# EAGLE design chgr (EAGLE 4.13)
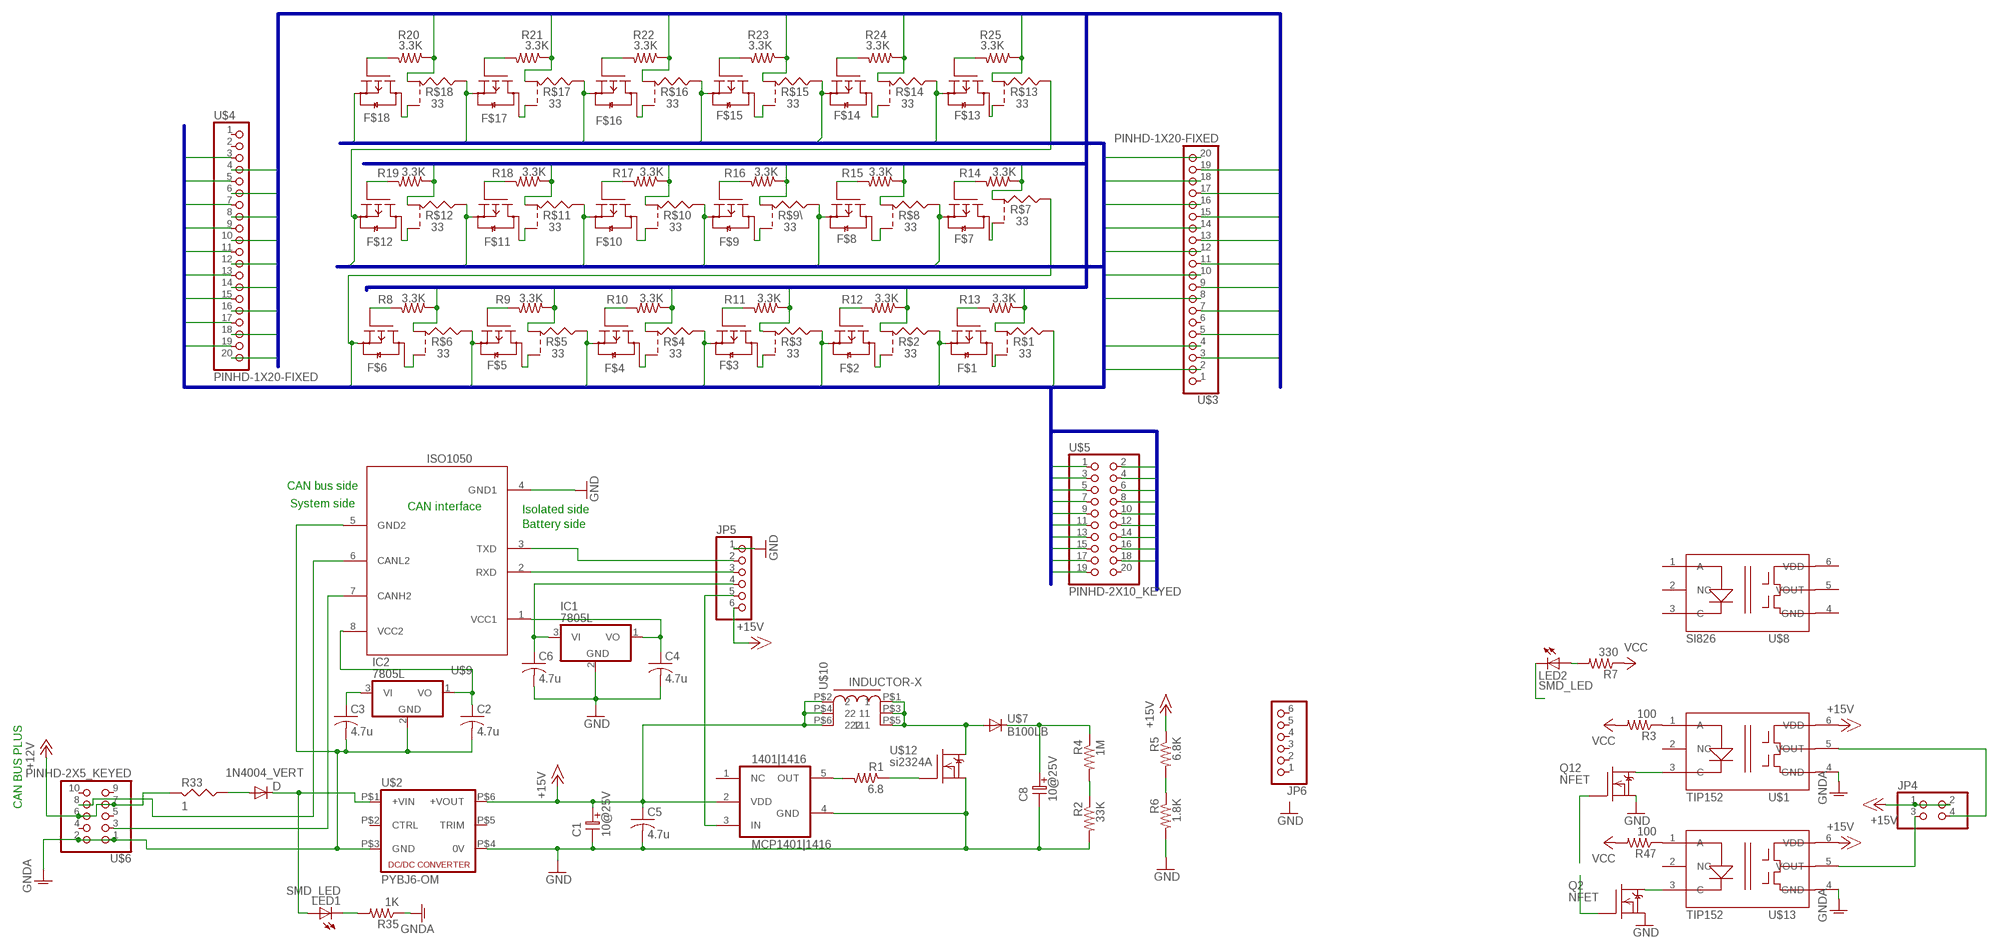
[diagram p0: schematic, sheet 1]

## Parts
1401|1416  MCP1401|1416  MCP1416  [SOT23-5]
C1  10@25V  ELC-2,5L  [ES-2,5L]
C2  4.7u  C-USC0603  [C0603]
C3  4.7u  C-USC0603  [C0603]
C4  4.7u  C-USC0603  [C0603]
C5  4.7u  C-USC0603  [C0603]
C6  4.7u  C-USC0603  [C0603]
C8  10@25V  ELC-2,5L  [ES-2,5L]
D  1N4004_VERT  [DO41-10_VERT]
F$1  FET-P-SOT23  [SOT-23]
F$2  FET-P-SOT23  [SOT-23]
F$3  FET-P-SOT23  [SOT-23]
F$4  FET-P-SOT23  [SOT-23]
F$5  FET-P-SOT23  [SOT-23]
F$6  FET-P-SOT23  [SOT-23]
F$7  FET-P-SOT23  [SOT-23]
F$8  FET-P-SOT23  [SOT-23]
F$9  FET-P-SOT23  [SOT-23]
F$10  FET-P-SOT23  [SOT-23]
F$11  FET-P-SOT23  [SOT-23]
F$12  FET-P-SOT23  [SOT-23]
F$13  FET-P-SOT23  [SOT-23]
F$14  FET-P-SOT23  [SOT-23]
F$15  FET-P-SOT23  [SOT-23]
F$16  FET-P-SOT23  [SOT-23]
F$17  FET-P-SOT23  [SOT-23]
F$18  FET-P-SOT23  [SOT-23]
IC1  7805L  [TO92]
IC2  7805L  [TO92]
JP4  PINHD-2X2  [2X02]
JP5  PINHD-1X6  [1X06]
JP6  PINHD-1X6  [1X06]
LED1  SMD_LED  [SMD_LED]
LED2  SMD_LED  [SMD_LED]
Q2  NFET  DMN3404L  [SOT-23]
Q12  NFET  DMN3404L  [SOT-23]
R1  6.8  R-US_R0603  [R0603]
R2  33K  R-US_R0603  [R0603]
R3  100  R-US_R0603  [R0603]
R4  1M  R-US_R0603  [R0603]
R5  6.8K  R-US_R0603  [R0603]
R6  1.8K  R-US_R0603  [R0603]
R7  330  R-US_R0603  [R0603]
R8  3.3K  R-US_R0603  [R0603]
R9  3.3K  R-US_R0603  [R0603]
R10  3.3K  R-US_R0603  [R0603]
R11  3.3K  R-US_R0603  [R0603]
R12  3.3K  R-US_R0603  [R0603]
R13  3.3K  R-US_R0603  [R0603]
R14  3.3K  R-US_R0603  [R0603]
R15  3.3K  R-US_R0603  [R0603]
R16  3.3K  R-US_R0603  [R0603]
R17  3.3K  R-US_R0603  [R0603]
R18  3.3K  R-US_R0603  [R0603]
R19  3.3K  R-US_R0603  [R0603]
R20  3.3K  R-US_R0603  [R0603]
R21  3.3K  R-US_R0603  [R0603]
R22  3.3K  R-US_R0603  [R0603]
R23  3.3K  R-US_R0603  [R0603]
R24  3.3K  R-US_R0603  [R0603]
R25  3.3K  R-US_R0603  [R0603]
R33  1  RESUS-S2,5  [RS-2,5]
R35  1K  R-US_R0603  [R0603]
R47  100  R-US_R0603  [R0603]
R$1  33  RESUS-S2,5-2  [RS-2,5-2]
R$2  33  RESUS-S2,5-2  [RS-2,5-2]
R$3  33  RESUS-S2,5-2  [RS-2,5-2]
R$4  33  RESUS-S2,5-2  [RS-2,5-2]
R$5  33  RESUS-S2,5-2  [RS-2,5-2]
R$6  33  RESUS-S2,5-2  [RS-2,5-2]
R$7  33  RESUS-S2,5-2  [RS-2,5-2]
R$8  33  RESUS-S2,5-2  [RS-2,5-2]
R$9\  33  RESUS-S2,5-2  [RS-2,5-2]
R$10  33  RESUS-S2,5-2  [RS-2,5-2]
R$11  33  RESUS-S2,5-2  [RS-2,5-2]
R$12  33  RESUS-S2,5-2  [RS-2,5-2]
R$13  33  RESUS-S2,5-2  [RS-2,5-2]
R$14  33  RESUS-S2,5-2  [RS-2,5-2]
R$15  33  RESUS-S2,5-2  [RS-2,5-2]
R$16  33  RESUS-S2,5-2  [RS-2,5-2]
R$17  33  RESUS-S2,5-2  [RS-2,5-2]
R$18  33  RESUS-S2,5-2  [RS-2,5-2]
U$1  TIP152  SI826  [SDIP6]
U$2  PYBJ6-OM  [PYBJ6-OM]
U$3  PINHD-1X20-FIXED  [1X20]
U$4  PINHD-1X20-FIXED  [1X20]
U$5  PINHD-2X10_KEYED  [2X10_KEYED]
U$6  PINHD-2X5_KEYED  [2X05_KEYED]
U$7  B100LB  [SMB_1]
U$8  SI826  [SDIP6]
U$9  ISO1050  [PDSO-G8]
U$10  INDUCTOR-X  [INDUCTOR]
U$12  si2324A  DMN3404L  [SOT-23]
U$13  TIP152  SI826  [SDIP6]

## Nets
+5VA: C2.1 IC2.1(VO) U$9.8(VCC2)
+5VB: C4.1 IC1.1(VO) U$9.1(VCC1)
+7V: C6.1 IC1.3(VI) JP5.4
+12V: R33.2 U$6.6 U$6.7
+12V_RESISTORED: D.A R33.1
+15V: 1401|1416.2(VDD) C1.1 C5.1 JP4.1 JP4.2 JP5.6 R5.1 U$1.6(VDD) U$2.P$6(+VOUT) U$10.P$2 U$10.P$4 U$10.P$6 U$13.6(VDD)
C0: R$1.1 U$3.2 U$5.1
C1: F$1.2(S) R$2.1 U$3.4 U$5.11
C2: F$2.2(S) R$3.1 U$5.2
C3: F$3.2(S) R$4.1 U$3.8 U$5.12
C4: F$4.2(S) R$5.1 U$3.10 U$5.3
C5: F$5.2(S) R$6.1 U$3.12 U$5.13
C6: F$6.2(S) R$7.1 U$3.14 U$5.4
C7: F$7.2(S) R$8.1 U$3.16 U$5.14
C8: F$8.2(S) R$9\.1 U$3.18 U$5.5
C9: F$9.2(S) R$10.1 U$3.20 U$5.15
C10: F$10.2(S) R$11.1 U$4.19 U$5.6
C11: F$11.2(S) R$12.1 U$4.17 U$5.16
C12: F$12.2(S) R$13.1 U$4.15 U$5.7
C13: F$13.2(S) R$14.1 U$4.13 U$5.17
C14: F$14.2(S) R$15.1 U$4.11 U$5.8
C15: F$15.2(S) R$16.1 U$4.9 U$5.18
C16: F$16.2(S) R$17.1 U$4.7 U$5.9
C17: F$17.2(S) R$18.1 U$4.5 U$5.19
C18: F$18.2(S) U$4.3 U$5.10
CAN+12PROTECT: D.C LED1.A U$2.P$1(+VIN)
CAN-RX: JP5.3 U$9.2(RXD)
CAN-TX: JP5.2 U$9.3(TXD)
CANH2: U$6.3 U$9.7(CANH2)
CANL2: U$6.8 U$9.6(CANL2)
CHG-PWM: 1401|1416.3(IN) JP5.5
CHG_FETDRV: 1401|1416.5(OUT) R1.2
GHR_FET_GATE: R1.1 U$12.1(G)
GND: 1401|1416.4(GND) C1.2 C4.2 C5.2 C6.2 C8.2 IC1.2(GND) JP5.1 Q2.2(S) Q12.2(S) R2.2 R6.2 U$2.P$4(0V) U$9.4(GND1) U$12.2(S)
GNDA: C2.2 C3.2 IC2.2(GND) R35.1 U$1.4(GND) U$2.P$3(GND) U$6.1 U$6.2 U$9.5(GND2) U$13.4(GND)
LED_BUS_PWR: LED1.C R35.2
LED|R: LED2.A R7.2
N$1: F$18.1(G) R20.2
N$2: C3.1 IC2.3(VI)
N$3: JP4.3 U$13.5(VOUT)
N$4: C8.1 R4.1 U$7.C
N$5: R2.1 R4.2
N$6: U$7.A U$10.P$1 U$10.P$3 U$10.P$5 U$12.3(D)
N$7: R5.2 R6.1
N$8: JP4.4 U$1.5(VOUT)
N$9: F$17.1(G) R21.2
N$10: R3.1 U$1.1(A)
N$11: R47.1 U$13.1(A)
N$12: Q12.3(D) U$1.3(C)
N$13: Q2.3(D) U$13.3(C)
N$14: Q2.1(G)
N$15: Q12.1(G)
N$16: F$16.1(G) R22.2
N$17: F$15.1(G) R23.2
N$18: F$14.1(G) R24.2
N$19: F$13.1(G) R25.2
N$20: F$7.1(G) R14.2
N$21: F$8.1(G) R15.2
N$22: F$9.1(G) R16.2
N$23: F$10.1(G) R17.2
N$24: F$11.1(G) R18.2
N$25: F$12.1(G) R19.2
N$26: F$6.1(G) R8.2
N$27: F$5.1(G) R9.2
N$28: F$4.1(G) R10.2
N$29: F$3.1(G) R11.2
N$30: F$2.1(G) R12.2
N$31: F$18.3(D) R$18.3
N$32: F$17.3(D) R$17.3
N$33: F$16.3(D) R$16.3
N$34: F$15.3(D) R$15.3
N$35: F$14.3(D) R$14.3
N$36: F$13.3(D) R$13.3
N$37: F$7.3(D) R$7.3
N$38: F$8.3(D) R$8.3
N$39: F$9.3(D) R$9\.3
N$40: F$10.3(D) R$10.3
N$41: F$11.3(D) R$11.3
N$42: F$12.3(D) R$12.3
N$43: F$6.3(D) R$6.3
N$44: F$5.3(D) R$5.3
N$45: F$4.3(D) R$4.3
N$46: F$3.3(D) R$3.3
N$47: F$2.3(D) R$2.3
N$48: F$1.3(D) R$1.3
N$49: F$1.1(G) R13.2
PB8|LED: LED2.C
S1: R13.1 R$1.2 U$3.3
S2: R12.1 R$2.2 U$3.5
S3: R11.1 R$3.2 U$3.7
S4: R10.1 R$4.2 U$3.9
S5: R9.1 R$5.2 U$3.11
S6: R8.1 R$6.2 U$3.13
S7: R14.1 R$7.2 U$3.15
S8: R15.1 R$8.2 U$3.17
S9: R16.1 R$9\.2 U$3.19
S10: R17.1 R$10.2 U$4.20
S11: R18.1 R$11.2 U$4.18
S12: R19.1 R$12.2 U$4.16
S13: R25.1 R$13.2 U$4.14
S14: R24.1 R$14.2 U$4.12
S15: R23.1 R$15.2 U$4.10
S16: R22.1 R$16.2 U$4.8
S17: R21.1 R$17.2 U$4.6
S18: R20.1 R$18.2 U$4.4
VCC: R3.2 R7.1 R47.2
Unconnected: 1401|1416.1(NC) JP6.1 JP6.2 JP6.3 JP6.4 JP6.5 JP6.6 U$1.2(NC) U$2.P$2(CTRL) U$2.P$5(TRIM) U$3.1 U$3.6 U$4.1 U$4.2 U$5.20 U$6.4 U$6.5 U$6.9 U$6.10 U$8.1(A) U$8.2(NC) U$8.3(C) U$8.5(VOUT) U$13.2(NC)

## Buses
C$1:C[0..18]
S$!:S[0..18]

## Notes on the sheet
- CAN bus side
- System side | CAN interface
- Isolated side
- Battery side
- CAN BUS PLUS

## Power pins joined to a net without a drawn wire
GND: U$8.4(GND)
VDD: U$8.6(VDD)

## Library data of the parts
1401|1416 = DEH:MCP1416
C1 C8 = DEH:ELC-2,5L
C2-C6 = rcl:C-US: CAPACITOR, American symbol
D = diode:1N4004_VERT
F$1-F$18 = transistor-fet:FET-P-SOT23
IC1 IC2 = linear:78*: Positive VOLTAGE REGULATOR
JP4 = pinhead:PINHD-2X2: PIN HEADER
JP5 JP6 = pinhead:PINHD-1X6: PIN HEADER
LED1 LED2 = led:SMD_LED
Q2 Q12 U$12 = transistor-fet:DMN3404L
R1-R25 R35 R47 = rcl:R-US_: RESISTOR, American symbol
R33 = DEH:RESUS-S2,5
R$1-R$8 R$9\ R$10-R$18 = DEH:RESUS-S2,5-2
U$1 U$8 U$13 = DEH:SI826
U$2 = dc-dc-converter:PYBJ6-OM
U$3 U$4 = pinhead:PINHD-1X20-FIXED
U$5 = pinhead:PINHD-2X10_KEYED
U$6 = pinhead:PINHD-2X5_KEYED
U$7 = diode-1:B100LB
U$9 = texas:ISO1050
U$10 = DEH:INDUCTOR-X

## Board
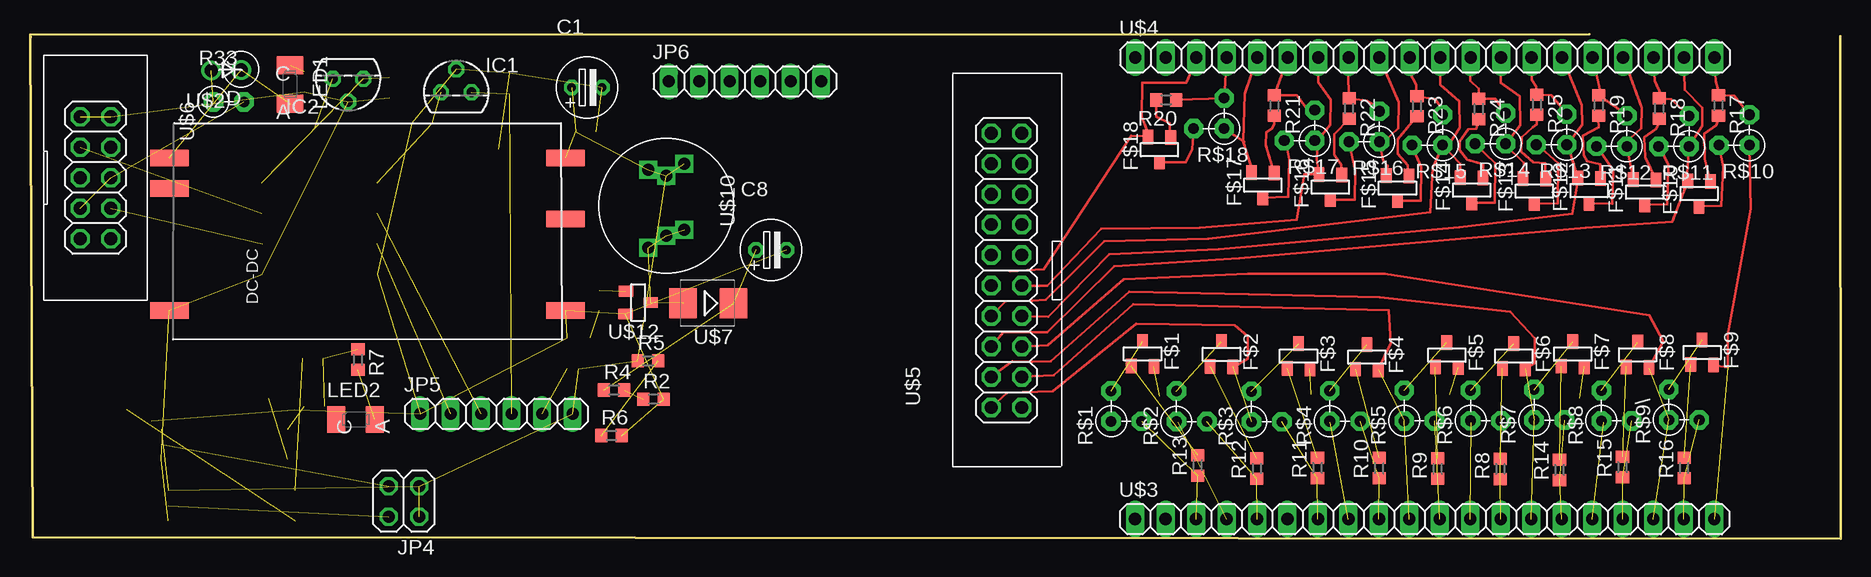
[diagram p1: board, top side]
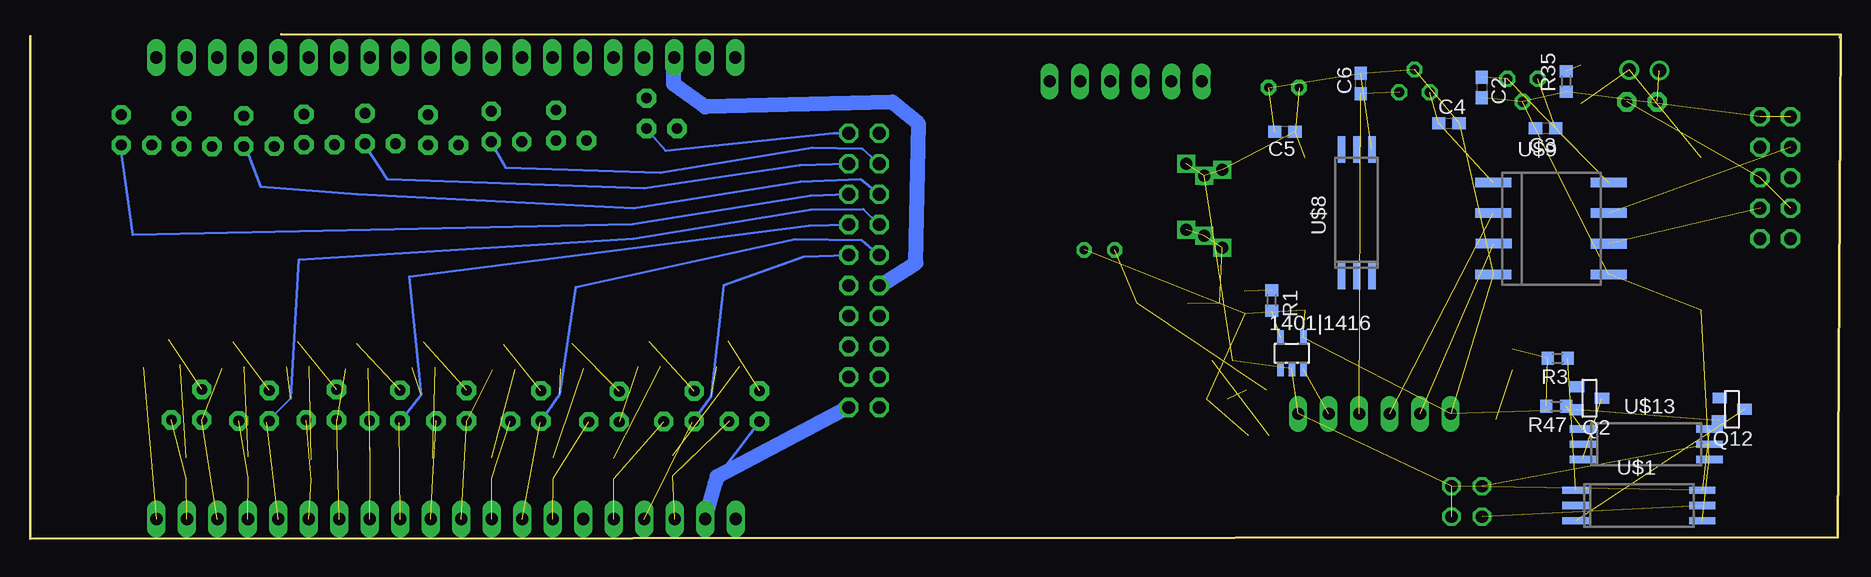
[diagram p2: board, bottom side, seen from below]

Size 150.89 x 42.04 mm. Coordinates in mm from the lower left corner, seen from the top.
Outline: 0,41.96 0.23,0.09 150.89,0 150.86,41.84
Outline: 0,41.96 0.07,41.79
Outline: 0,41.96 129.94,42.04
Copper layers (1*16): Top 0.035mm / dielectric 1.5mm / Bottom 0.035mm
Design rules "default": minimum track width 8mil, minimum drill 0.6mm, track to track 0.2083mm, track to pad 8mil, pad to pad 8mil, via to via 8mil, smd to smd 0mil, copper to edge 8mil, drill to drill 8mil, minimum pad ring 10mil, minimum via ring 8mil, stop-mask expansion 4mil, vias tented up to drill 0mil, thermal gap 10mil

### Footprints (pad centres in the part's own frame; a part is rotated, then mirrored left to right if it is on the bottom)
SOT23-5 = smd 0.55 x 1.2: 1 -0.95,-1.3; 2 0,-1.3; 3 0.95,-1.3; 4 0.95,1.3; 5 -0.95,1.3
ES-2,5L = drill 0.711 pad 1.27 octagon: 1 0,0; 2 2.54,0
C0603 = smd 1.1 x 1: 1 -0.85,0; 2 0.85,0
DO41-10_VERT = drill 1.1 round: A 2.58,0.05; C 0.07,0
SOT-23 = smd 0.9 x 1.2: 1 -1,-1.006; 2 0.9,-1.056; 3 -0.05,1.056
TO92 = drill 0.813 octagon: 1 -1.27,0; 2 0,1.905; 3 1.27,0
2X02 = drill 1.016 octagon: 1 -1.27,-1.27; 2 -1.27,1.27; 3 1.27,-1.27; 4 1.27,1.27
1X06 = drill 1 long: 1 -6.35,0; 2 -3.81,0; 3 -1.27,0; 4 1.27,0; 5 3.81,0; 6 6.35,0
SMD_LED = smd 2.2 x 1.5: A 0,1.6; C 0,-1.6
R0603 = smd 1 x 1.1: 1 -0.85,0; 2 0.85,0
RS-2,5 = drill 0.889 pad 1.6 octagon: 1 0,0; 2 2.54,0
RS-2,5-2 = drill 0.889 pad 1.6 octagon: 1 0,0; 2 2.54,0; 3 0,2.54
SDIP6 = smd 0.6 x 2.2: 1 -1.895,-5.33; 2 -0.625,-5.33; 3 0.645,-5.33; 4 0.645,5.22; 5 -0.625,5.22; 6 -1.895,5.22
PYBJ6-OM = smd 3.2 x 1.397: P$1 -16.51,6.35; P$2 -16.51,3.81; P$3 -16.51,-6.35; P$4 16.51,-6.35; P$5 16.51,1.27; P$6 16.51,6.35
1X20 = drill 1.016 long: 1 -24.13,0; 2 -21.59,0; 3 -19.05,0; 4 -16.51,0; 5 -13.97,0; 6 -11.43,0; 7 -8.89,0; 8 -6.35,0; 9 -3.81,0; 10 -1.27,0; 11 1.27,0; 12 3.81,0; 13 6.35,0; 14 8.89,0; 15 11.43,0; 16 13.97,0; 17 16.51,0; 18 19.05,0; 19 21.59,0; 20 24.13,0
2X10_KEYED = drill 1.067 octagon: 1 -11.46,-1.27; 2 -11.46,1.27; 3 -8.92,-1.27; 4 -8.92,1.27; 5 -6.38,-1.27; 6 -6.38,1.27; 7 -3.84,-1.27; 8 -3.84,1.27; 9 -1.3,-1.27; 10 -1.3,1.27; 11 1.24,-1.27; 12 1.24,1.27; 13 3.78,-1.27; 14 3.78,1.27; 15 6.32,-1.27; 16 6.32,1.27; 17 8.86,-1.27; 18 8.86,1.27; 19 11.4,-1.27; 20 11.4,1.27
2X05_KEYED = drill 1.067 octagon: 1 -5.08,-1.27; 2 -5.08,1.27; 3 -2.54,-1.27; 4 -2.54,1.27; 5 0,-1.27; 6 0,1.27; 7 2.54,-1.27; 8 2.54,1.27; 9 5.08,-1.27; 10 5.08,1.27
SMB_1 = smd 2.3 x 2.5: A 1.9,0; C -2.3,0
PDSO-G8 = smd 0.8 x 3: 1 -3.825,-4.8; 2 -1.275,-4.8; 3 1.265,-4.78; 4 3.825,-4.8; 5 3.825,4.8; 6 1.275,4.8; 7 -1.275,4.81; 8 -3.825,4.81
INDUCTOR = drill 1 pad 1.27 octagon: 1 -2.47,0 | drill 1 square: P$1 2.5,0; P$2 -2.5,0; P$3 2,1.5; P$4 -3,-1.5; P$5 3.5,-1.5; P$6 -3.5,1.5

### Placement (x,y rotation side)
1401|1416  45.73,15.44 0 bottom
C1  45.14,37.58 0 top
C2  29.92,37.58 270 bottom
C3  24.59,34.18 180 bottom
C4  32.65,34.6 0 bottom
C5  46.32,33.89 180 bottom
C6  39.98,37.92 90 bottom
C8  60.5,24.05 0 top
D  17.68,39.05 180 top
F$1  92.76,15.38 0 top
F$2  99.34,15.35 0 top
F$3  105.76,15.19 0 top
F$4  111.46,15.11 0 top
F$5  118.12,15.29 0 top
F$6  123.7,15.19 0 top
F$7  128.61,15.36 0 top
F$8  134.02,15.31 0 top
F$9  139.39,15.5 0 top
F$10  139.04,28.73 180 top
F$11  134.5,28.86 180 top
F$12  129.87,28.99 180 top
F$13  125.31,28.95 180 top
F$14  120.09,29.03 180 top
F$15  113.91,29.2 180 top
F$16  108.31,29.29 180 top
F$17  102.69,29.44 180 top
F$18  94.07,32.41 180 top
IC1  35.52,37.18 0 top
IC2  26.51,38.3 180 top
JP4  31.16,3.09 180 top
JP5  38.86,10.38 0 top
JP6  59.58,38.1 0 top
LED1  21.68,37.82 180 top
LED2  27.12,9.92 270 top
Q2  20.95,11.64 270 bottom
Q12  9.07,10.71 270 bottom
R1  47.42,19.84 270 bottom
R2  51.96,11.61 0 top
R3  23.58,15.02 180 bottom
R4  48.68,12.37 0 top
R5  51.51,14.81 0 top
R6  48.46,8.58 0 top
R7  27.33,14.91 270 top
R8  122.53,5.8 90 top
R9  117.31,5.82 90 top
R10  112.43,5.86 90 top
R11  107.29,5.89 90 top
R12  102.24,5.83 90 top
R13  97.31,6.09 90 top
R14  127.46,5.72 90 top
R15  132.71,5.95 90 top
R16  137.85,5.88 90 top
R17  140.71,36.08 270 top
R18  135.77,35.83 270 top
R19  130.73,36.09 270 top
R20  94.69,36.55 180 top
R21  103.69,36.07 270 top
R22  109.93,35.83 270 top
R23  115.58,36.02 270 top
R24  120.73,35.8 270 top
R25  125.57,36.15 270 top
R33  15.29,36.38 0 top
R35  22.87,38.09 90 bottom
R47  23.7,11.02 180 bottom
R$1  90.09,9.76 0 top
R$2  95.54,9.75 0 top
R$3  101.79,9.72 0 top
R$4  108.31,9.77 0 top
R$5  114.51,9.8 0 top
R$6  120.05,9.81 0 top
R$7  125.34,9.87 0 top
R$8  130.95,9.8 0 top
R$9\  136.57,9.88 0 top
R$10  143.29,32.78 90 top
R$11  138.26,32.67 90 top
R$12  133.08,32.68 90 top
R$13  128.06,32.82 90 top
R$14  122.97,32.9 90 top
R$15  117.72,32.78 90 top
R$16  112.45,33.06 90 top
R$17  107.06,33.16 90 top
R$18  99.51,34.16 90 top
U$1  16.76,2.12 270 bottom
U$2  28.12,25.36 0 top
U$3  116.22,1.62 0 top
U$4  116.24,40.09 0 top
U$5  81.38,22.38 90 top
U$6  5.45,30.07 270 top
U$7  56.33,19.61 180 top
U$8  39.71,27.21 0 bottom
U$9  24.14,25.84 270 bottom
U$10  53.03,27.74 270 top
U$12  50.67,19.61 270 top
U$13  16.16,7.23 270 bottom

### Tracks (layer width: path | path; a pad name or v marks a point on that pad's centre or on a via)
+5VA  (2 unrouted)
+5VB  (2 unrouted)
+7V  (2 unrouted)
+12V  (2 unrouted)
+12V_RESISTORED  (1 unrouted)
+15V  (12 unrouted)
C0
  Bottom 0.202: 93.81,4.57 93.98,4.62 R$1.1
  Bottom 1.27: U$5.1 93.64,5.16 93.81,4.57 94.71,1.5 U$3.2
C1  (2 unrouted)
  Bottom 0.202: U$5.11 86.43,23.49 93.06,21.1 94.13,11.84 95.69,9.69 R$2.1
C2  (1 unrouted)
  Top 0.202: U$5.2 81.45,12.15 85.21,12.28 92.19,17.88 100.4,17.79 101.47,16.86 101.47,14.97 100.26,14.29 F$2.2
C3  (2 unrouted)
  Bottom 0.202: U$5.12 81.56,24.85 87.11,24.95 105.43,20.95 106.75,12.03 108.36,9.69 R$4.1
C4  (2 unrouted)
  Top 0.202: U$5.3 85.3,13.59 91.95,19.51 113.24,19.04 113.4,16.28 112.3,14.03 F$4.2
C5  (2 unrouted)
  Bottom 0.202: U$5.13 85.94,26.07 119.27,21.83 118.3,11.98 120.1,9.64 R$6.1
C6  (2 unrouted)
  Top 0.202: U$5.4 81.86,14.77 83.52,14.73 85.06,14.78 91.59,20.58 101.57,20.35 112.47,20.1 123.34,18.9 125.4,16.67 125.4,14.59 124.63,14.19 F$6.2
C7  (2 unrouted)
  Bottom 0.202: U$5.14 81.46,27.44 85.84,27.39 100.56,25 128.48,23.24 129.16,11.69 131.16,9.69 R$8.1
C8  (2 unrouted)
  Top 0.202: U$5.5 84.83,16.1 91.13,21.59 101.52,22.06 112.9,22.08 134.94,18.59 136.11,16.42 134.91,14.19 F$8.2
C9  (1 unrouted)
  Top 0.202: R$10.1 143.38,27.47 141.46,17 141.46,14.28 140.24,14.42 F$9.2
  Bottom 0.202: U$5.15 85.87,28.55 100.69,26.18 142.31,25.3 143.36,32.78 R$10.1
C10
  Top 0.202: U$4.19 137.9,37.41 139.37,35.89 139.37,34.39 138.15,32.48 R$11.1 138.06,29.91 F$10.2 138.16,29.76 136.87,26.41 129.66,25.88 100.77,23.34 90.36,22.7 84.76,17.18 83.57,17.2 81.12,17.2 U$5.6
C11
  Top 0.202: U$4.17 134.31,35.91 134.27,34.19 132.85,32.89 R$12.1 133.62,29.96 F$11.2
  Bottom 0.202: U$5.16 81.66,29.94 86.71,29.74 100.59,27.53 123.61,28.69 131.65,29.33 133.01,32.82 R$12.1
C12
  Top 0.202: U$5.7 84.87,18.5 89.92,23.67 99.07,24.12 119.12,25.94 128.5,27.07 129.03,30.04 F$12.2 128.14,32.8 R$13.1 128.08,32.78 129.35,34.46 129.3,36.12 U$4.15
C13
  Top 0.202: U$4.13 122.56,37.99 124.13,36.86 124.18,34.44 122.92,32.82 | R$14.1 122.92,32.82 | 122.92,32.82 124.46,31.33 124.4,30.12 F$13.2
  Bottom 0.202: U$5.17 86.73,31.11 99.69,29.19 121.14,29.94 123.01,32.8 R$14.1
C14
  Top 0.202: U$4.11 117.51,37.8 119.1,36.43 119.15,34.22 118.23,32.8 R$15.1 | R$15.1 119.17,31.23 119.18,30.81 F$14.2 | U$5.8 81.33,19.78 83.5,19.82 84.66,19.88 89.54,24.79 98.17,24.96 116.7,27.2 116.89,30.89 117.72,32.74 R$15.1
C15
  Top 0.202: U$4.9 114.07,36.36 114.03,34.2 112.75,33.04 R$16.1 112.77,31.49 113.13,31.05 113.03,30.38 F$15.2
  Bottom 0.202: U$5.18 81.54,32.5 85.69,32.56 98.35,30.5 111.26,30.88 112.47,33.03 R$16.1
C16
  Top 0.202: U$4.7 107.37,38.02 108.41,36.57 108.37,34.48 107.3,33.2 | 107.3,33.2 R$17.1 | 107.3,33.2 107.22,31.6 107.41,30.47 F$16.2 107.49,30.34 106.2,30.37 105.57,26.56 97.47,25.9 89.28,25.81 84.75,21.06 83.98,21.06 U$5.9
C17
  Top 0.202: U$4.5 101.21,37.06 101.1,33.13 101.12,33.06 | 101.75,30.56 F$17.2 101.87,30.69 101.12,33.06 | 101.12,33.06 101.17,33.08 R$18.1
  Bottom 0.202: R$18.1 99.59,34.19 97.92,32.3 83.91,33.76 U$5.19
C18
  Top 0.202: 81.64,22.27 84.48,22.42 91.78,33.57 93.21,33.54 F$18.2 93.27,33.54 92.64,35.13 92.7,37.98 96.37,37.98 97.25,40.06 U$4.3
  Bottom 1.27: U$4.3 97.25,37.87 94.62,35.97 79.02,36.36 76.83,34.55 77.07,22.95 80.24,20.95 U$5.10
CAN+12PROTECT  (2 unrouted)
CAN-RX  (1 unrouted)
CAN-TX  (1 unrouted)
CANH2  (1 unrouted)
CANL2  (1 unrouted)
CHG-PWM  (1 unrouted)
CHG_FETDRV  (1 unrouted)
GHR_FET_GATE  (1 unrouted)
GND  (15 unrouted)
GNDA  (9 unrouted)
LED_BUS_PWR  (1 unrouted)
LED|R  (1 unrouted)
N$1
  Top 0.202: R20.2 93.84,35.15 94.96,34.59 95.03,33.42 F$18.1
N$2  (1 unrouted)
N$3  (1 unrouted)
N$4  (2 unrouted)
N$5  (1 unrouted)
N$6  (4 unrouted)
N$7  (1 unrouted)
N$8  (1 unrouted)
N$9
  Top 0.202: F$17.1 102.97,32.79 103.04,33.86 103.46,34.16 103.69,34.52 R21.2
N$10  (1 unrouted)
N$11  (1 unrouted)
N$12  (1 unrouted)
N$13  (1 unrouted)
N$16
  Top 0.202: R22.2 108.68,33.68 108.7,31.99 109.27,31.14 109.37,30.4 F$16.1
N$17
  Top 0.202: R23.2 113.96,33.26 113.96,32.05 114.83,31.09 114.82,30.16 F$15.1
N$18
  Top 0.202: F$14.1 121.09,31.18 119.78,31.55 119.13,32.34 119.16,33.09 119.86,34.1 120.53,34.15 120.74,34.9 R24.2
N$19
  Top 0.202: F$13.1 126.28,31.28 125.28,31.35 124.25,32.25 124.3,33.45 125.21,34.28 125.57,34.51 125.55,35.26 R25.2
N$20  (1 unrouted)
N$21  (1 unrouted)
N$22  (1 unrouted)
N$23
  Top 0.202: F$10.1 139.58,31.65 139.51,33.71 140.51,34.43 140.78,35.24 R17.2
N$24
  Top 0.202: F$11.1 134.61,31.77 134.53,33.44 135.5,34.16 135.95,35.02 R18.2
N$25
  Top 0.202: F$12.1 130.87,31.2 129.76,31.43 129.47,31.95 129.4,33.58 130.71,34.27 130.68,34.92 R19.2
N$26  (1 unrouted)
N$27  (1 unrouted)
N$28  (1 unrouted)
N$29  (1 unrouted)
N$30  (1 unrouted)
N$31
  Top 0.202: F$18.3 96.31,31.36 96.85,32.43 96.96,34.2 R$18.3
N$32
  Top 0.202: F$17.3 104.85,28.47 104.94,31.62 104.59,33.27 R$17.3
N$33
  Top 0.202: F$16.3 110.39,28.21 110.42,30.63 109.89,33.1 R$16.3
N$34
  Top 0.202: F$15.3 115.9,28.14 115.93,30.93 115.18,32.65 R$15.3
N$35
  Top 0.202: F$14.3 122.08,27.97 122.1,31.26 120.38,32.88 R$14.3
N$36
  Top 0.202: F$13.3 127.32,27.95 127.36,31.28 125.57,32.85 R$13.3
N$37  (1 unrouted)
N$38  (1 unrouted)
N$39  (1 unrouted)
N$40
  Top 0.202: F$10.3 140.95,27.74 141.1,30.99 140.72,32.83 R$10.3
N$41
  Top 0.202: F$11.3 136.43,27.84 136.52,31.2 135.73,32.74 R$11.3
N$42
  Top 0.202: F$12.3 131.86,27.91 131.95,30.7 130.57,32.67 R$12.3
N$43  (1 unrouted)
N$44  (1 unrouted)
N$45  (1 unrouted)
N$46  (1 unrouted)
N$47  (1 unrouted)
N$48  (1 unrouted)
N$49  (1 unrouted)
S1  (2 unrouted)
S2  (2 unrouted)
S3  (2 unrouted)
S4  (2 unrouted)
S5  (2 unrouted)
S6  (2 unrouted)
S7  (2 unrouted)
S8  (2 unrouted)
S9  (2 unrouted)
S10
  Top 0.202: U$4.20 140.46,38.11 140.78,37.05 R17.1 142.03,36.9 143.32,35.28 R$10.2
S11
  Top 0.202: U$4.18 135.38,38.13 135.95,36.93 R18.1 136.77,36.59 138.31,35.15 R$11.2
S12
  Top 0.202: U$4.16 130.84,37.29 R19.1 133.17,35.23 R$12.2
S13
  Top 0.202: U$4.14 125.16,38.21 125.51,37.66 125.58,37.02 R25.1 126.79,36.93 128.09,35.36 R$13.2
S14
  Top 0.202: U$4.12 120.04,38.13 120.72,37.46 120.74,36.67 R24.1 122.1,36.64 122.94,35.43 R$14.2
S15
  Top 0.202: U$4.10 115.02,40.08 114.97,38.83 115.52,37.8 R23.1 117.11,36.62 117.72,35.74 R$15.2
S16
  Top 0.202: U$4.8 109.85,38.16 R22.1 111.41,36.48 111.96,36.15 R$16.2
S17
  Top 0.202: U$4.6 104.82,40.07 104.11,38.05 R21.1 105.55,36.92 106.31,35.92 R$17.2 107.28,35.79
S18
  Top 0.202: U$4.4 99.5,36.68 R$18.2 99.55,36.67 R20.1
VCC  (2 unrouted)

### Text on the board
bNames: 5
tValues: 3.3V | DIGITAL | +5V | 3.2v | ANALOG | 3.2